# Altium schematic sheet TFT_2.2-inch_ILI9341_Sch.SchDoc: TFT_2.2-inch_ILI9341
size 127 x 127 mm; Author: Hom; CompanyName: KitSprout; DrawnBy: Hom; Engineer: Hom; Organization: KitSprout; Revision: A; SheetNumber: 1; SheetTotal: 1; Version: 1.2; LibVersion: 1.0; PageSetup: Record=PageOptions|CenterHorizontal=True|CenterVertical=True|PrintScale=1.00|XCorrection=1.00|YCorrection=1.00|PrintKind=0|BorderSize=5000000|LeftOffset=0|BottomOffset=0|Orientation=2|PaperLength=1000|PaperWidth=1000|Scale=100|PaperSource=7|PrintQuality=-4|MediaType=1|DitherType=10|PaperKind=A4|PrintScaleMode=0
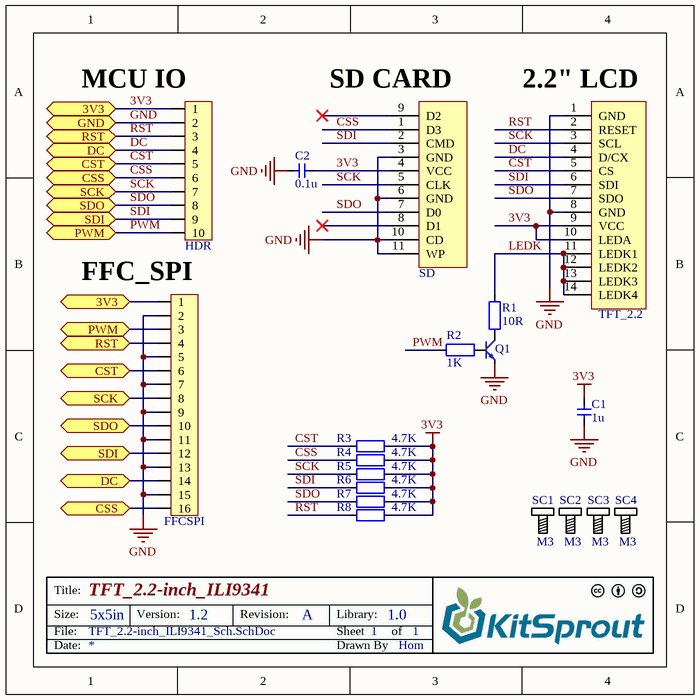
[diagram p0: TFT_2.2-inch_ILI9341_Sch.SchDoc]

## Parts
C1  value 1u  [CAP_0603]  (hidden comment: Cap_0603)
C2  value 0.1u  [CAP_0603]  (hidden comment: Cap_0603)
FFCSPI  FFC_0.5_16  [FFC_0.5_16]  (value not drawn)
HDR  HDR1x10_2.54  [HDR1X10_2.54_180]  (value not drawn)
Q1  BJT_NPN  [SOT23-3]  (value not drawn)
R1  value 10R  [RES_0603]  (hidden comment: Res_0603)
R2  value 1K  [RES_0603]  (hidden comment: Res_0603)
R3  value 4.7K  [RES_0603]  (hidden comment: Res_0603)
R4  value 4.7K  [RES_0603]  (hidden comment: Res_0603)
R5  value 4.7K  [RES_0603]  (hidden comment: Res_0603)
R6  value 4.7K  [RES_0603]  (hidden comment: Res_0603)
R7  value 4.7K  [RES_0603]  (hidden comment: Res_0603)
R8  value 4.7K  [RES_0603]  (hidden comment: Res_0603)
SC1  M3  [SCRREW_M3]
SC2  M3  [SCRREW_M3]
SC3  M3  [SCRREW_M3]
SC4  M3  [SCRREW_M3]
SD  SD_Card  [SD_Card_1]  (value not drawn)
TFT_2.2  TFT_2.2_ILI9341  [TFT_2.2_320x240_ILI9341]  (value not drawn)

## Ports
3V3, CSS, CST, DC, GND, PWM, RST, SCK, SDI, SDO

## Nets
3V3: C1.2 C2.2 FFCSPI.1 HDR.1 R3.1 R4.1 R5.1 R6.1 R7.1 R8.1 SD.4(VCC) TFT_2.2.9(VCC) TFT_2.2.10(LEDA) ; port 3V3
GND: C1.1 C2.1 FFCSPI.2 FFCSPI.5 FFCSPI.7 FFCSPI.9 FFCSPI.11 FFCSPI.13 FFCSPI.15 HDR.2 Q1.2(E) SD.3(GND) SD.6(GND) SD.10(CD) SD.11(WP) TFT_2.2.1(GND) TFT_2.2.8(GND) ; port GND
CSS: FFCSPI.16 HDR.6 R4.2 SD.1(D3) ; port CSS
CST: FFCSPI.6 HDR.5 R3.2 TFT_2.2.5(CS) ; port CST
DC: FFCSPI.14 HDR.4 TFT_2.2.4(D/CX) ; port DC
LEDK: R1.2 TFT_2.2.11(LEDK1) TFT_2.2.12(LEDK2) TFT_2.2.13(LEDK3) TFT_2.2.14(LEDK4)
PWM: FFCSPI.3 HDR.10 R2.2 ; port PWM
RST: FFCSPI.4 HDR.3 R8.2 TFT_2.2.2(RESET) ; port RST
SCK: FFCSPI.8 HDR.7 R5.2 SD.5(CLK) TFT_2.2.3(SCL) ; port SCK
SDI: FFCSPI.12 HDR.9 R6.2 SD.2(CMD) TFT_2.2.6(SDI) ; port SDI
SDO: FFCSPI.10 HDR.8 R7.2 SD.7(D0) TFT_2.2.7(SDO) ; port SDO
NetQ1_1: Q1.1(B) R2.1
NetQ1_3: Q1.3(C) R1.1

Not connected (* = marked no-connect by the designer): SD 8(D1)* 9(D2)*

## Notes on the sheet
- (near HDR) MCU IO
- (near SD) SD CARD
- (near TFT_2.2) 2.2" LCD
- (near FFCSPI) FFC_SPI
- Title:
- Size:
- Date:
- File:
- 5x5in
- Version:
- Revision:
- Sheet
- Drawn By
- Library:
- of

## Library data of the parts
C1 C2 = Cap_0603: Capacitor
FFCSPI = FFC_0.5_16: FFC
HDR = HDR1x10_2.54: Header
Q1 = BJT_NPN: Transistor
R1-R8 = Res_0603: Resistor
SC1-SC4 = Screw_M3: Screw
SD = SD_Card: SD
TFT_2.2 = TFT_2.2_ILI9341: TFT